# EAGLE design rc2014_nsc800 (EAGLE 8.1.0)
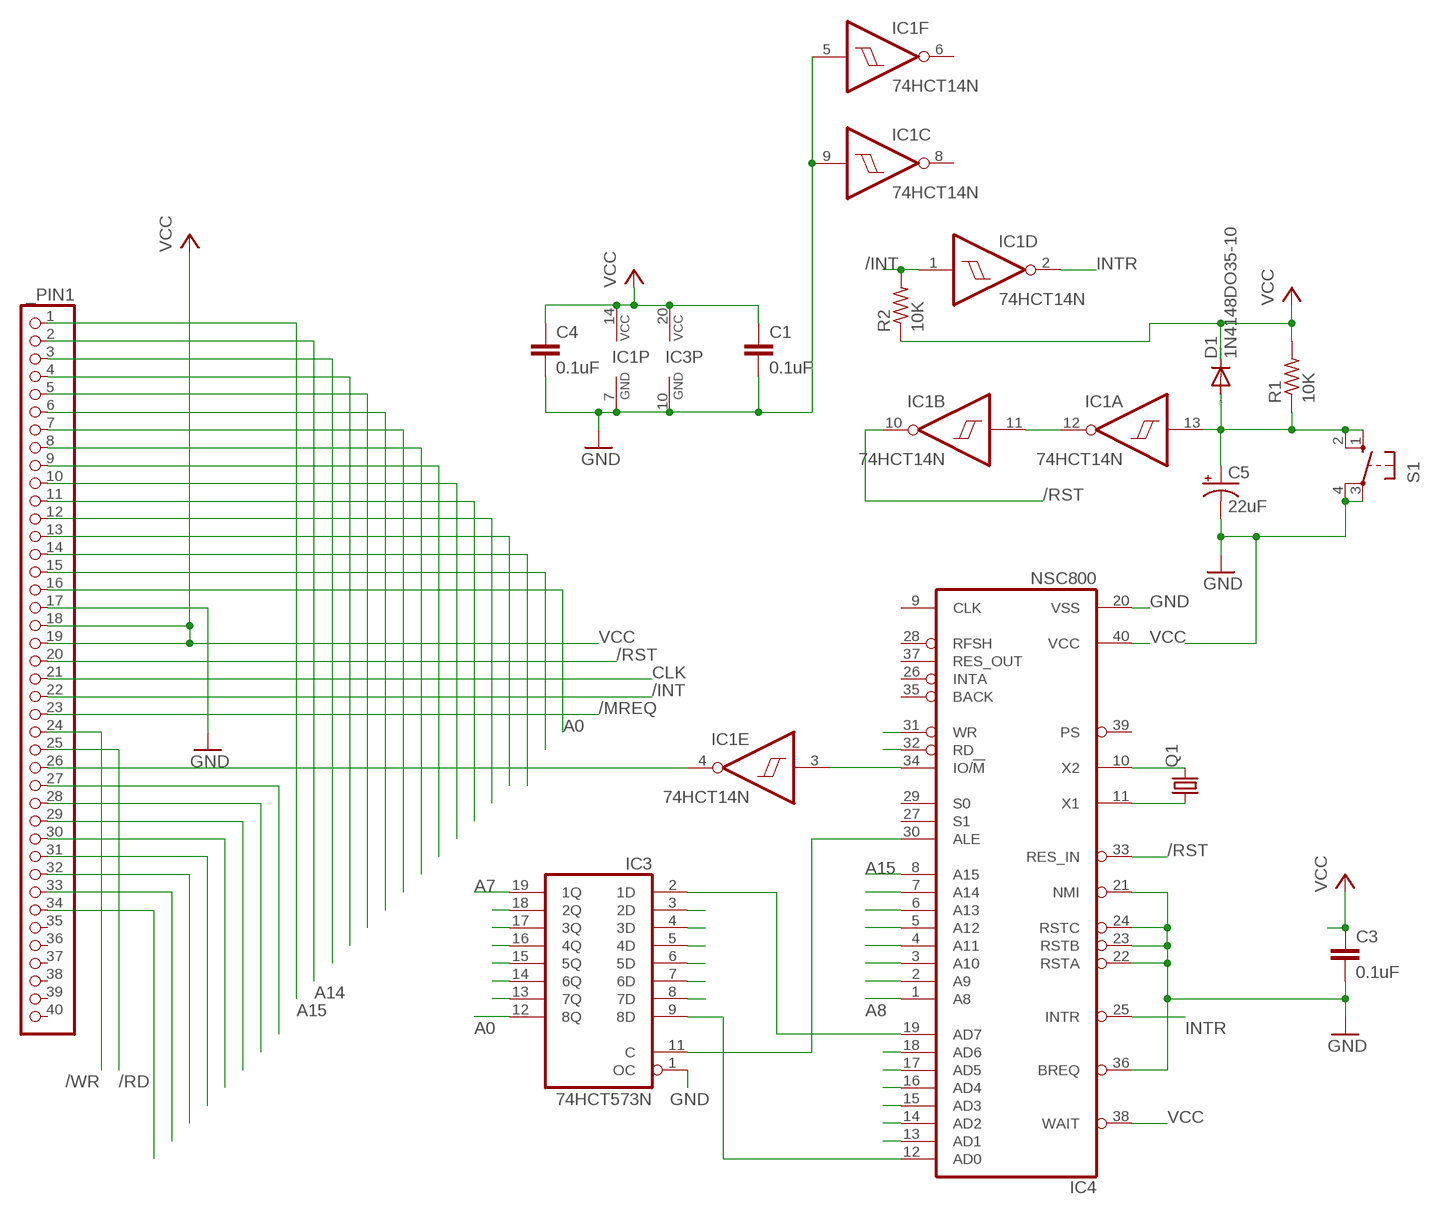
[diagram p0: schematic, sheet 1]

## Parts
_PIN1  PINHD-1X40  [1X40]
C1  0.1uF  C-EU050-024X044  [C050-024X044]
C3  0.1uF  C-EU050-024X044  [C050-024X044]
C4  0.1uF  C-EU050-024X044  [C050-024X044]
C5  22uF  CPOL-USTAP5-80  [TAP5-80]
D1  1N4148DO35-10  [DO35-10]
IC1  74HCT14N  [DIL14]
IC3  74HCT573N  [DIL20]
IC4  NSC800  [DIL40]
Q1  CRYSTALHC49S  [HC49/S]
R1  10K  R-US_0207/10  [0207/10]
R2  10K  R-US_0207/10  [0207/10]
S1  10-XX  [B3F-10XX]

## Nets
/INT: _PIN1.22 IC1.1(D:I) R2.2
/IORQ: _PIN1.26 IC1.4(E:O)
/MREQ: _PIN1.23 IC1.3(E:I) IC4.34(IO/!M)
/RD: _PIN1.25 IC4.32(RD)
/RST: _PIN1.20 IC1.10(B:O) IC4.33(RES_IN)
/WR: _PIN1.24 IC4.31(WR)
A0: _PIN1.16 IC3.12(8Q)
A1: _PIN1.15 IC3.13(7Q)
A2: _PIN1.14 IC3.14(6Q)
A3: _PIN1.13 IC3.15(5Q)
A4: _PIN1.12 IC3.16(4Q)
A5: _PIN1.11 IC3.17(3Q)
A6: _PIN1.10 IC3.18(2Q)
A7: _PIN1.9 IC3.19(1Q)
A8: _PIN1.8 IC4.1(A8)
A9: _PIN1.7 IC4.2(A9)
A10: _PIN1.6 IC4.3(A10)
A11: _PIN1.5 IC4.4(A11)
A12: _PIN1.4 IC4.5(A12)
A13: _PIN1.3 IC4.6(A13)
A14: _PIN1.2 IC4.7(A14)
A15: _PIN1.1 IC4.8(A15)
CLK: _PIN1.21
D0: _PIN1.27 IC3.9(8D) IC4.12(AD0)
D1: _PIN1.28 IC3.8(7D) IC4.13(AD1)
D2: _PIN1.29 IC3.7(6D) IC4.14(AD2)
D3: _PIN1.30 IC3.6(5D) IC4.15(AD3)
D4: _PIN1.31 IC3.5(4D) IC4.16(AD4)
D5: _PIN1.32 IC3.4(3D) IC4.17(AD5)
D6: _PIN1.33 IC3.3(2D) IC4.18(AD6)
D7: _PIN1.34 IC3.2(1D) IC4.19(AD7)
GND: _PIN1.17 C1.2 C3.2 C4.2 C5.- IC1.5(F:I) IC1.7(P:GND) IC1.9(C:I) IC3.1(OC) IC3.10(GND) IC4.20(VSS) IC4.21(NMI) IC4.22(RSTA) IC4.23(RSTB) IC4.24(RSTC) IC4.36(BREQ) S1.3(P) S1.4(P1)
INTR: IC1.2(D:O) IC4.25(INTR)
N$2: IC3.11(C) IC4.30(ALE)
N$5: IC4.11(X1) Q1.1
N$6: IC4.10(X2) Q1.2
N$15: IC1.11(B:I) IC1.12(A:O)
RESET: C5.+ D1.A IC1.13(A:I) R1.1 S1.1(S) S1.2(S1)
VCC: _PIN1.18 _PIN1.19 C1.1 C3.1 C4.1 D1.C IC1.14(P:VCC) IC3.20(VCC) IC4.38(WAIT) IC4.40(VCC) R1.2 R2.1
Unconnected: _PIN1.35 _PIN1.36 _PIN1.37 _PIN1.38 _PIN1.39 _PIN1.40 IC1.6(F:O) IC1.8(C:O) IC4.9(CLK) IC4.26(INTA) IC4.27(S1) IC4.28(RFSH) IC4.29(S0) IC4.35(BACK) IC4.37(RES_OUT) IC4.39(PS)

## Library data of the parts
_PIN1 = pinhead:PINHD-1X40: PIN HEADER
C1 C3 C4 = rcl:C-EU: CAPACITOR, European symbol
C5 = rcl:CPOL-US: POLARIZED CAPACITOR, American symbol
D1 = diode:1N4148: DIODE high speed (Philips)
IC1 = 74xx-eu:74*14: Hex schmitt trigger INVERTER
IC3 = 74xx-eu:74*573: 8-bit D latch BUS DRIVER
IC4 = nsc800:NSC800: MICROCOMPUTER/PERIPHERAL DEVICE; OC_FARNELL: unknown; OC_NEWARK: unknown
Q1 = crystal:CRYSTAL: CRYSTAL; OC_FARNELL: 1667008; OC_NEWARK: unknown
R1 R2 = rcl:R-US_: RESISTOR, American symbol
S1 = switch-omron:10-XX: OMRON SWITCH; MPN: B3F-1000; OC_FARNELL: 176432; OC_NEWARK: 36M3542

## Net classes
0 +5V: width 0.508 mm

## Board
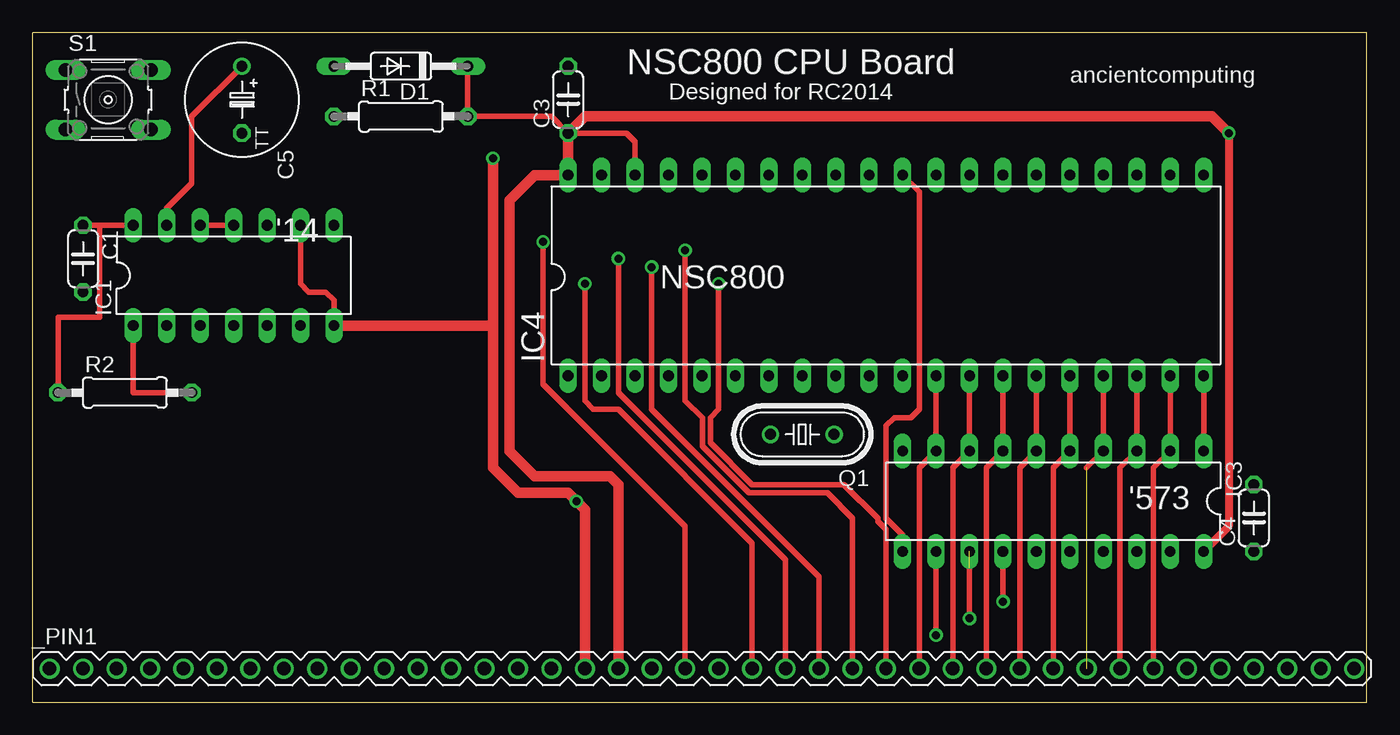
[diagram p1: board, top side]
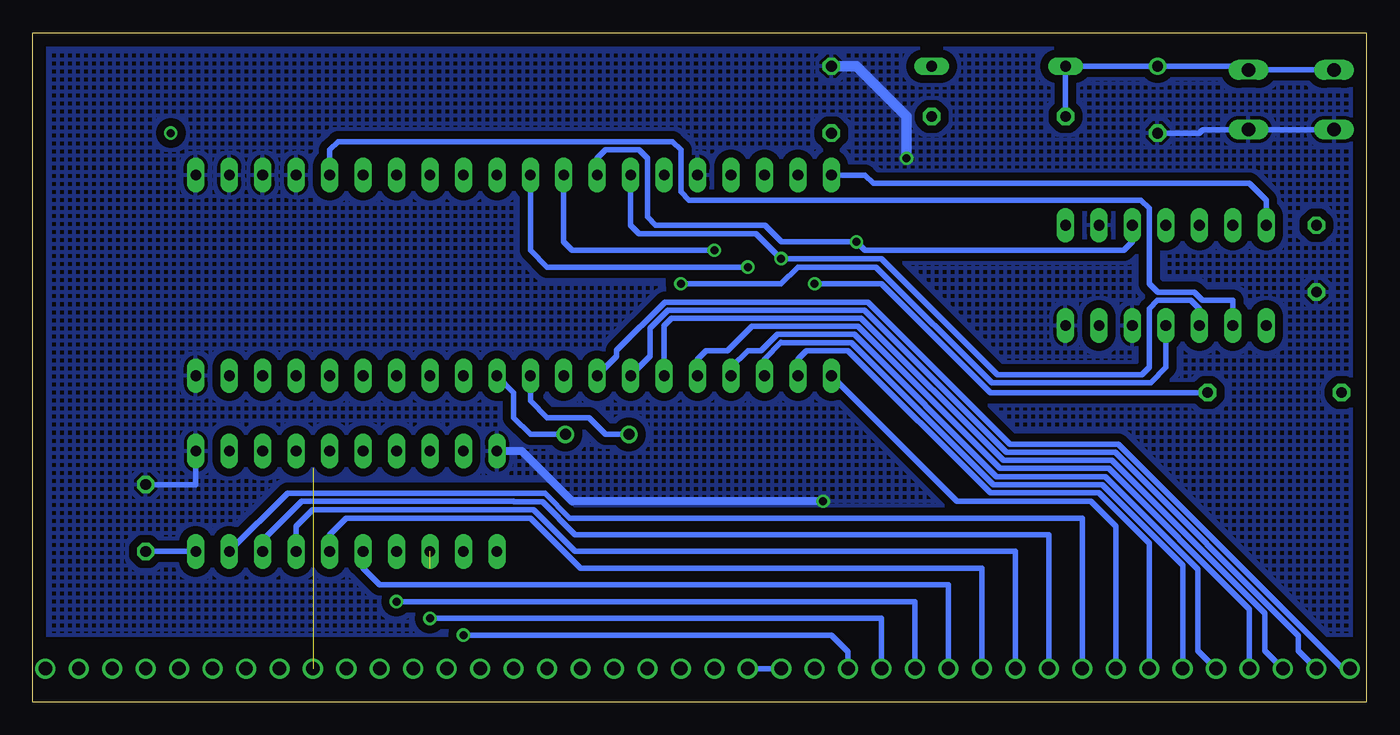
[diagram p2: board, bottom side, seen from below]

Size 101.27 x 50.79 mm. Coordinates in mm from the lower left corner, seen from the top.
Outline: 0,0 101.27,0 101.27,50.79 0,50.79 0,0
Copper layers (1*16): Top 0.035mm / dielectric 1.5mm / Bottom 0.035mm
Design rules "default *": minimum track width 20mil, minimum drill 24mil, track to track 8mil, track to pad 8mil, pad to pad 8mil, via to via 8mil, smd to smd 8mil, copper to edge 40mil, drill to drill 8mil, minimum pad ring 10mil, minimum via ring 8mil, stop-mask expansion 4mil, vias tented up to drill 0mil, thermal gap 10mil

### Footprints (pad centres in the part's own frame; a part is rotated, then mirrored left to right if it is on the bottom)
1X40 = drill 1.016: 1 -49.53,0; 2 -46.99,0; 3 -44.45,0; 4 -41.91,0; 5 -39.37,0; 6 -36.83,0; 7 -34.29,0; 8 -31.75,0; 9 -29.21,0; 10 -26.67,0; 11 -24.13,0; 12 -21.59,0; 13 -19.05,0; 14 -16.51,0; 15 -13.97,0; 16 -11.43,0; 17 -8.89,0; 18 -6.35,0; 19 -3.81,0; 20 -1.27,0; 21 1.27,0; 22 3.81,0; 23 6.35,0; 24 8.89,0; 25 11.43,0; 26 13.97,0; 27 16.51,0; 28 19.05,0; 29 21.59,0; 30 24.13,0; 31 26.67,0; 32 29.21,0; 33 31.75,0; 34 34.29,0; 35 36.83,0; 36 39.37,0; 37 41.91,0; 38 44.45,0; 39 46.99,0; 40 49.53,0
C050-024X044 = drill 0.813 octagon: 1 -2.54,0; 2 2.54,0
TAP5-80 = drill 0.813: + -2.54,0 | drill 0.813 octagon: - 2.54,0
DO35-10 = drill 0.813 long: A 5.08,0; C -5.08,0
DIL14 = drill 0.813 long: 1 -7.62,-3.81; 2 -5.08,-3.81; 3 -2.54,-3.81; 4 0,-3.81; 5 2.54,-3.81; 6 5.08,-3.81; 7 7.62,-3.81; 8 7.62,3.81; 9 5.08,3.81; 10 2.54,3.81; 11 0,3.81; 12 -2.54,3.81; 13 -5.08,3.81; 14 -7.62,3.81
DIL20 = drill 0.813 long: 1 -11.43,-3.81; 2 -8.89,-3.81; 3 -6.35,-3.81; 4 -3.81,-3.81; 5 -1.27,-3.81; 6 1.27,-3.81; 7 3.81,-3.81; 8 6.35,-3.81; 9 8.89,-3.81; 10 11.43,-3.81; 11 11.43,3.81; 12 8.89,3.81; 13 6.35,3.81; 14 3.81,3.81; 15 1.27,3.81; 16 -1.27,3.81; 17 -3.81,3.81; 18 -6.35,3.81; 19 -8.89,3.81; 20 -11.43,3.81
DIL40 = drill 0.813 long: 1 -24.13,-7.62; 2 -21.59,-7.62; 3 -19.05,-7.62; 4 -16.51,-7.62; 5 -13.97,-7.62; 6 -11.43,-7.62; 7 -8.89,-7.62; 8 -6.35,-7.62; 9 -3.81,-7.62; 10 -1.27,-7.62; 11 1.27,-7.62; 12 3.81,-7.62; 13 6.35,-7.62; 14 8.89,-7.62; 15 11.43,-7.62; 16 13.97,-7.62; 17 16.51,-7.62; 18 19.05,-7.62; 19 21.59,-7.62; 20 24.13,-7.62; 21 24.13,7.62; 22 21.59,7.62; 23 19.05,7.62; 24 16.51,7.62; 25 13.97,7.62; 26 11.43,7.62; 27 8.89,7.62; 28 6.35,7.62; 29 3.81,7.62; 30 1.27,7.62; 31 -1.27,7.62; 32 -3.81,7.62; 33 -6.35,7.62; 34 -8.89,7.62; 35 -11.43,7.62; 36 -13.97,7.62; 37 -16.51,7.62; 38 -19.05,7.62; 39 -21.59,7.62; 40 -24.13,7.62
HC49/S = drill 0.813: 1 -2.413,0; 2 2.413,0
0207/10 = drill 0.813 octagon: 1 -5.08,0; 2 5.08,0
B3F-10XX = drill 1.016 long: 1 -3.251,2.261; 2 3.251,2.261; 3 -3.251,-2.261; 4 3.251,-2.261

### Placement (x,y rotation side)
_PIN1  50.8,2.54 0 top
C1  3.81,33.66 270 top
C3  40.64,45.72 90 top
C4  92.71,13.97 90 top
C5  15.88,45.72 270 top
D1  27.94,48.26 180 top
IC1  15.24,32.38 0 top
IC3  77.47,15.24 180 top
IC4  64.77,32.38 0 top
Q1  58.42,20.32 180 top
R1  27.94,44.45 0 top
R2  6.99,23.5 0 top
S1  5.71,45.72 0 top

### Tracks (layer width: path | path; a pad name or v marks a point on that pad's centre or on a via)
/INT  (via drill 0.61)
  Top 0.406: IC1.1 7.62,23.5 R2.2 | _PIN1.22 54.61,12.06 44.45,22.23 42.55,22.23 41.91,22.86 v41.91,31.75
  Bottom 0.406: v41.91,31.75 36.83,31.75 28.57,23.5 R2.2
/IORQ  (via drill 0.61)
  Top 0.406: _PIN1.26 64.77,13.11 64.16,13.72 64.16,13.95 61.59,16.51 54.61,16.51 51.44,19.68 51.44,21.59 52.07,22.23 v52.07,31.75
  Bottom 0.406: v52.07,31.75 44.45,31.75 43.18,33.02 37.24,33.02 28.46,24.24 16.4,24.24 15.24,25.4 IC1.4
/MREQ  (via drill 0.61)
  Top 0.406: _PIN1.23 57.15,10.79 44.45,23.5 v44.45,33.66
  Bottom 0.406: IC4.34 55.88,36.2 55.24,35.56 46.35,35.56 v44.45,33.66 36.83,33.66 28.03,24.85 17.06,24.85 16.51,25.4 16.51,29.84 15.88,30.48 13.34,30.48 12.7,29.84 IC1.3
/RD  (via drill 0.61)
  Top 0.406: _PIN1.25 62.23,13.97 60.33,15.88 54.38,15.88 50.83,19.43 50.83,21.57 49.53,22.86 v49.53,34.29
  Bottom 0.406: v49.53,34.29 60.33,34.29 60.96,34.92 IC4.32
/RST  (via drill 0.61)
  Top 0.406: _PIN1.20 49.53,13.34 38.73,24.13 v38.73,34.92
  Bottom 0.406: IC4.33 58.42,41.27 57.78,41.91 55.24,41.91 54.61,41.27 54.61,36.83 53.98,36.2 45.7,36.2 44.43,34.92 v38.73,34.92 38.1,34.29 18.41,34.29 17.78,34.92 IC1.10
/WR  (via drill 0.61)
  Top 0.406: _PIN1.24 59.69,9.53 46.99,22.23 v46.99,33.02
  Bottom 0.406: v46.99,33.02 62.23,33.02 63.5,34.29 IC4.31
A0  (via drill 0.61)
  Top 0.406: v68.58,5.08 IC3.12
  Bottom 0.406: v68.58,5.08 40.64,5.08 39.37,3.81 _PIN1.16
A1  (via drill 0.61)  (1 unrouted)
  Top 0.406: v71.12,6.35 71.12,10.16
  Bottom 0.406: v71.12,6.35 36.83,6.35 _PIN1.15
A2  (via drill 0.61)
  Top 0.406: v73.66,7.62 IC3.14
  Bottom 0.406: v73.66,7.62 34.29,7.62 _PIN1.14
A3
  Bottom 0.406: IC3.15 76.2,10.16 74.93,8.89 31.75,8.89 _PIN1.13
A4
  Bottom 0.406: IC3.16 78.74,12.7 77.47,13.97 63.5,13.97 59.69,10.16 29.21,10.16 _PIN1.12
A5
  Bottom 0.406: IC3.17 81.28,13.34 80.03,14.58 63.25,14.58 60.1,11.43 26.67,11.43 _PIN1.11
A6
  Bottom 0.406: _PIN1.10 24.13,12.7 60.1,12.7 62.59,15.19 64.72,15.19 64.77,15.24 80.87,15.24 83.82,12.29 IC3.18
A7
  Bottom 0.406: IC3.19 81.94,15.85 62.38,15.85 60.51,13.97 21.59,13.97 _PIN1.9
A8
  Bottom 0.406: _PIN1.8 19.05,13.34 20.95,15.24 31.11,15.24 IC4.1
A9
  Bottom 0.406: _PIN1.7 16.51,12.06 20.32,15.88 28.57,15.88 39.37,26.67 42.55,26.67 43.18,26.04 IC4.2
A10
  Bottom 0.406: _PIN1.6 13.97,10.39 20.07,16.48 20.93,16.48 20.95,16.51 28.35,16.51 39.12,27.28 44.42,27.28 44.45,27.3 45.72,26.04 IC4.3
A11
  Bottom 0.406: _PIN1.5 12.8,3.91 12.8,10.08 19.84,17.12 28.09,17.12 38.89,27.91 44.74,27.91 45.98,26.67 46.99,26.67 48.26,25.4 IC4.4
A12
  Bottom 0.406: _PIN1.4 8.89,7.03 19.59,17.73 27.84,17.73 38.64,28.52 46.67,28.52 48.52,26.67 50.16,26.67 50.8,26.04 IC4.5
A13
  Bottom 0.406: _PIN1.3 7.72,3.91 7.72,6.72 19.34,18.34 27.59,18.34 38.38,29.13 52.78,29.13 53.34,28.57 IC4.6
A14
  Bottom 0.406: _PIN1.2 5.18,3.91 5.18,5.05 19.08,18.95 27.34,18.95 38.13,29.74 53.03,29.74 54.41,28.37 54.41,26.24 IC4.7
A15
  Bottom 0.406: _PIN1.1 1.81,2.54 18.83,19.56 27.09,19.56 37.88,30.35 53.29,30.35 56.95,26.69 56.95,26.24 IC4.8
D0
  Top 0.406: _PIN1.27 67.31,17.78 IC3.9 IC4.12
D1
  Top 0.406: _PIN1.28 69.85,17.78 IC3.8 IC4.13
D2
  Top 0.406: _PIN1.29 72.39,17.78 IC3.7 IC4.14
D3
  Top 0.406: _PIN1.30 74.93,17.78 IC3.6 IC4.15
D4
  Top 0.406: _PIN1.31 77.47,17.78 IC3.5 IC4.16
D5  (1 unrouted)
  Top 0.406: 80.01,17.78 IC3.4 IC4.17
D6
  Top 0.406: _PIN1.33 82.55,17.78 IC3.3 IC4.18
D7
  Top 0.406: _PIN1.34 85.09,17.78 IC3.2 IC4.19
GND  (via drill 0.61)
  Top 0.406: IC4.20 IC3.1 | IC1.9 20.32,31.75 20.95,31.11 22.23,31.11 22.86,30.48 IC1.7
  Top 0.813: _PIN1.17 41.91,14.61 40.64,15.88 36.83,15.88 34.92,17.78 34.92,28.57 | IC1.7 34.92,28.57 | 34.92,28.57 v34.92,41.27
  Bottom 0.406: S1.3 S1.4 12.42,43.46 12.7,43.18 C5.- | C4.2 88.9,16.51 IC3.1
  Bottom 0.61: v41.27,15.24 60.33,15.24 64.14,19.05 IC3.10
  Bottom 0.813: v34.92,41.27 34.92,44.45 38.73,48.26 C3.2
  pour Bottom (isolate 0.61, hatched): 0,50.8 0,5.08 101.6,5.08 101.6,50.8
INTR
  Bottom 0.406: IC1.2 10.16,30.48 12.47,30.48 13.08,31.09 15.85,31.09 16.51,31.75 16.51,37.47 17.14,38.1 51.44,38.1 52.07,38.73 52.07,41.91 52.7,42.55 78.11,42.55 78.74,41.91 IC4.25
N$2
  Top 0.406: IC3.11 66.04,12.7 64.77,13.97 64.77,20.95 65.41,21.59 66.67,21.59 67.31,22.23 67.31,38.73 IC4.30
N$5
  Bottom 0.406: Q1.1 63.5,20.32 64.77,21.59 64.77,23.5 IC4.11
N$6
  Bottom 0.406: Q1.2 57.78,20.32 59.05,21.59 62.23,21.59 63.5,22.86 IC4.10
N$15
  Top 0.406: IC1.12 IC1.11
RESET
  Top 0.406: C5.+ 12.06,44.45 12.06,39.37 10.16,37.47 IC1.13
  Bottom 0.406: S1.1 S1.2 8.61,48.26 C5.+ D1.A R1.1
VCC  (via drill 0.61)
  Top 0.406: D1.C R1.2 39.37,44.45 C3.1 45.09,43.18 45.72,42.55 IC4.38 | 5.08,36.2 IC1.14 | 5.08,36.2 C1.1 | R2.1 1.91,29.21 5.08,29.21 5.08,36.2
  Top 0.61: v90.81,43.18 90.81,13.34 IC3.20
  Top 0.813: _PIN1.18 44.45,16.51 43.81,17.14 38.1,17.14 36.2,19.05 36.2,38.1 38.1,40.01 IC4.40 C3.1 41.91,44.45 89.53,44.45 v90.81,43.18
  Bottom 0.406: IC3.20 C4.1 | _PIN1.19 _PIN1.18 | IC1.14 7.62,38.1 8.89,39.37 37.47,39.37 38.1,40.01 IC4.40

### Text on the board
tNames: NSC800 CPU Board | ancientcomputing | Designed for RC2014 | '14 | '573